# EAGLE design SatNOGSBoard UNO (EAGLE 6.5.0)
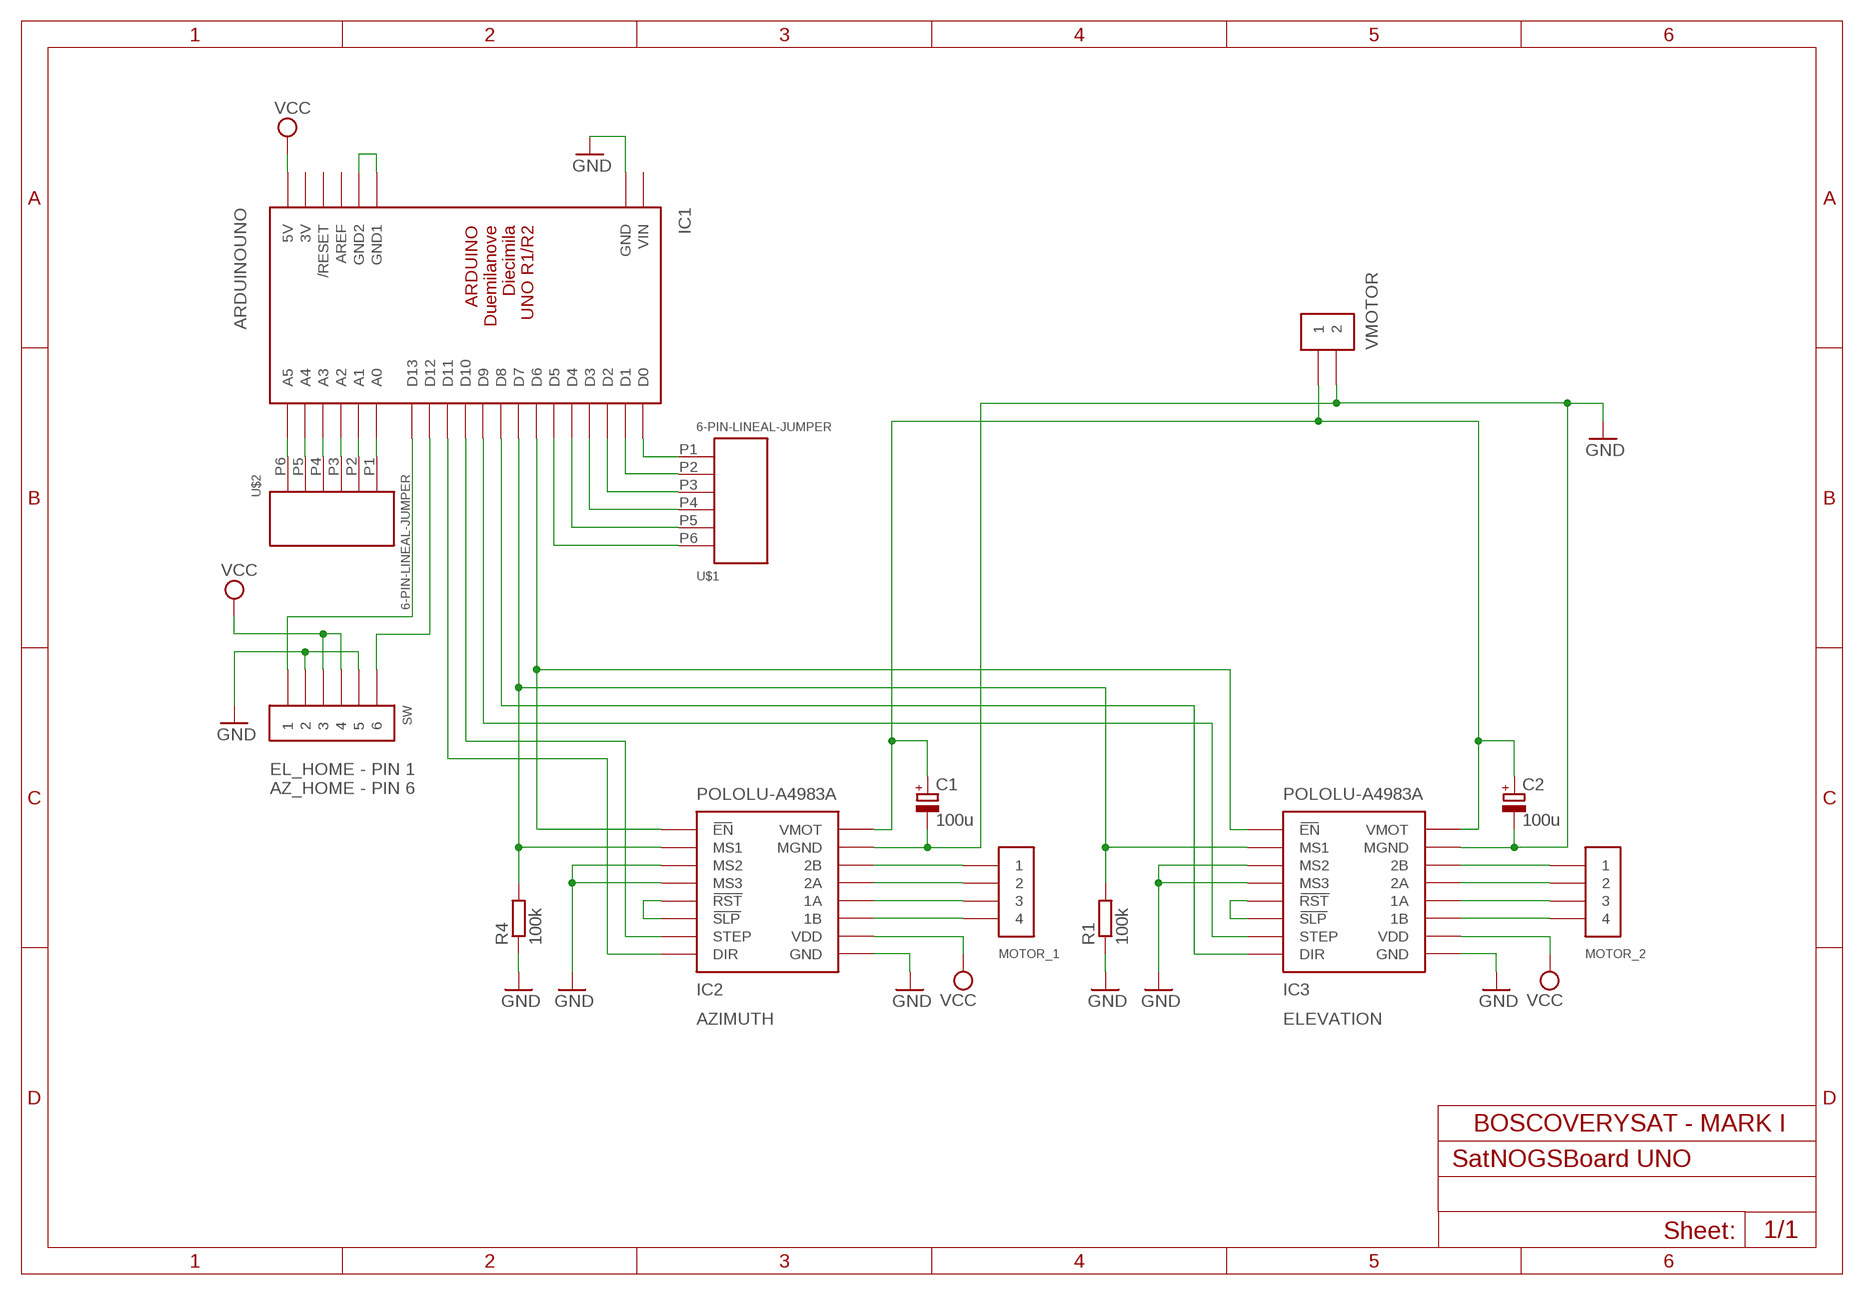
[diagram p0: schematic, sheet 1]

## Parts
C1  100u  CPOL-EUB45181B  [B45181B]
C2  100u  CPOL-EUB45181B  [B45181B]
IC1  ARDUINOUNO  [ARDUINO]
IC2  POLOLU-A4983A  [POLOLU-A4983]
IC3  POLOLU-A4983A  [POLOLU-A4983]
MOTOR_1  4-WIRE-CONNECTOR  [4-WIRE-CONNECTOR]
MOTOR_2  4-WIRE-CONNECTOR  [4-WIRE-CONNECTOR]
R1  100k  R-EU_0309/10  [0309/10]
R4  100k  R-EU_0309/10  [0309/10]
SW  6-PIN-JUMPER  [6-PIN-JUMPER]
U$1  6-PIN-LINEAL-JUMPER  [6-PIN-LINEAR-JUMPER]
U$2  6-PIN-LINEAL-JUMPER  [6-PIN-LINEAR-JUMPER]
VMOTOR  2-WIRE-CONNECTOR  [2-WIRE-CONNECTOR]

## Nets
GND: C1.- C2.- IC1.GND IC2.P$3(MS2) IC2.P$4(MS3) IC2.P$9(GND) IC2.P$15(MGND) IC3.P$3(MS2) IC3.P$4(MS3) IC3.P$9(GND) IC3.P$15(MGND) R1.1 R4.1 SW.P$2 SW.P$5 VMOTOR.P$2
N$1: IC1.D6 IC2.P$1(EN) IC3.P$1(EN)
N$2: IC1.D7 IC2.P$2(MS1) IC3.P$2(MS1) R1.2 R4.2
N$3: IC3.P$5(RST) IC3.P$6(SLP)
N$4: IC1.D9 IC3.P$7(STEP)
N$5: IC1.D8 IC3.P$8(DIR)
N$6: IC1.D0 U$1.P1
N$7: IC1.D1 U$1.P2
N$8: IC1.D11 IC2.P$8(DIR)
N$9: IC1.D12 SW.P$6
N$10: IC3.P$14(2B) MOTOR_2.P$1
N$11: IC3.P$13(2A) MOTOR_2.P$2
N$12: IC3.P$12(1A) MOTOR_2.P$3
N$13: IC3.P$11(1B) MOTOR_2.P$4
N$14: IC2.P$5(RST) IC2.P$6(SLP)
N$15: IC1.D2 U$1.P3
N$16: IC1.D13 SW.P$1
N$17: IC1.D3 U$1.P4
N$18: IC1.D10 IC2.P$7(STEP)
N$19: IC2.P$14(2B) MOTOR_1.P$1
N$20: IC2.P$13(2A) MOTOR_1.P$2
N$21: IC2.P$12(1A) MOTOR_1.P$3
N$22: IC2.P$11(1B) MOTOR_1.P$4
N$23: IC1.D4 U$1.P5
N$24: IC1.D5 U$1.P6
N$25: IC1.A0 U$2.P1
N$26: C1.+ C2.+ IC2.P$16(VMOT) IC3.P$16(VMOT) VMOTOR.P$1
N$27: IC1.A1 U$2.P2
N$28: IC1.A2 U$2.P3
N$29: IC1.A3 U$2.P4
N$30: IC1.A4 U$2.P5
N$31: IC1.A5 U$2.P6
N$33: IC1.GND1 IC1.GND2
VCC: IC1.5V IC2.P$10(VDD) IC3.P$10(VDD) SW.P$3 SW.P$4
Unconnected: IC1.AREF IC1.RESET(/RESET)

## Notes on the sheet
- EL_HOME - PIN 1
  AZ_HOME - PIN 6
- AZIMUTH | ELEVATION

## Power pins joined to a net without a drawn wire
3V: IC1.3V
VIN: IC1.VIN

## Library data of the parts
C1 C2 = resistor:CPOL-EU: POLARIZED CAPACITOR, European symbol
IC1 = boscoverysat:ARDUINO: Arduino Diecimila/Duemilanove Make a shield with ease, this package has all the named pins as well as the two mounting drill holes and an outline of the USB and DC power connector. The outline is on the DIMENSION layer, so if your board house uses it they will cut the outline to match. http://www.ladyada.net/library/pcb/eaglelibrary.html Package: ARDUINO Arduino Uno Make a shield with ease, this package has all the named pins as well as the two mounting drill holes and an outline of the USB and DC power connector. The outline is on the DIMENSION layer, so if your board house uses it they will cut the outline to match.
IC2 IC3 = boscoverysat:POLOLU-A4983: The A4983 stepper motor driver carrier is a breakout board for Allegro’s easy-to-use A4983 microstepping bipolar stepper motor driver. The driver features adjustable current limiting and five different microstep resolutions. It operates from 8 – 35 V and can deliver up to 2 A per coil.
MOTOR_1 MOTOR_2 = boscoverysat:4-WIRE-CONNECTOR
R1 R4 = resistor:R-EU_: RESISTOR, European symbol
SW = boscoverysat:6-PIN-JUMPER
U$1 U$2 = boscoverysat:6-PIN-LINEAL-JUMPER
VMOTOR = boscoverysat:2-WIRE-CONNECTOR

## Net classes
0 default: width 0.889 mm, drill 0.889 mm, clearance 0.889 mm

## Board
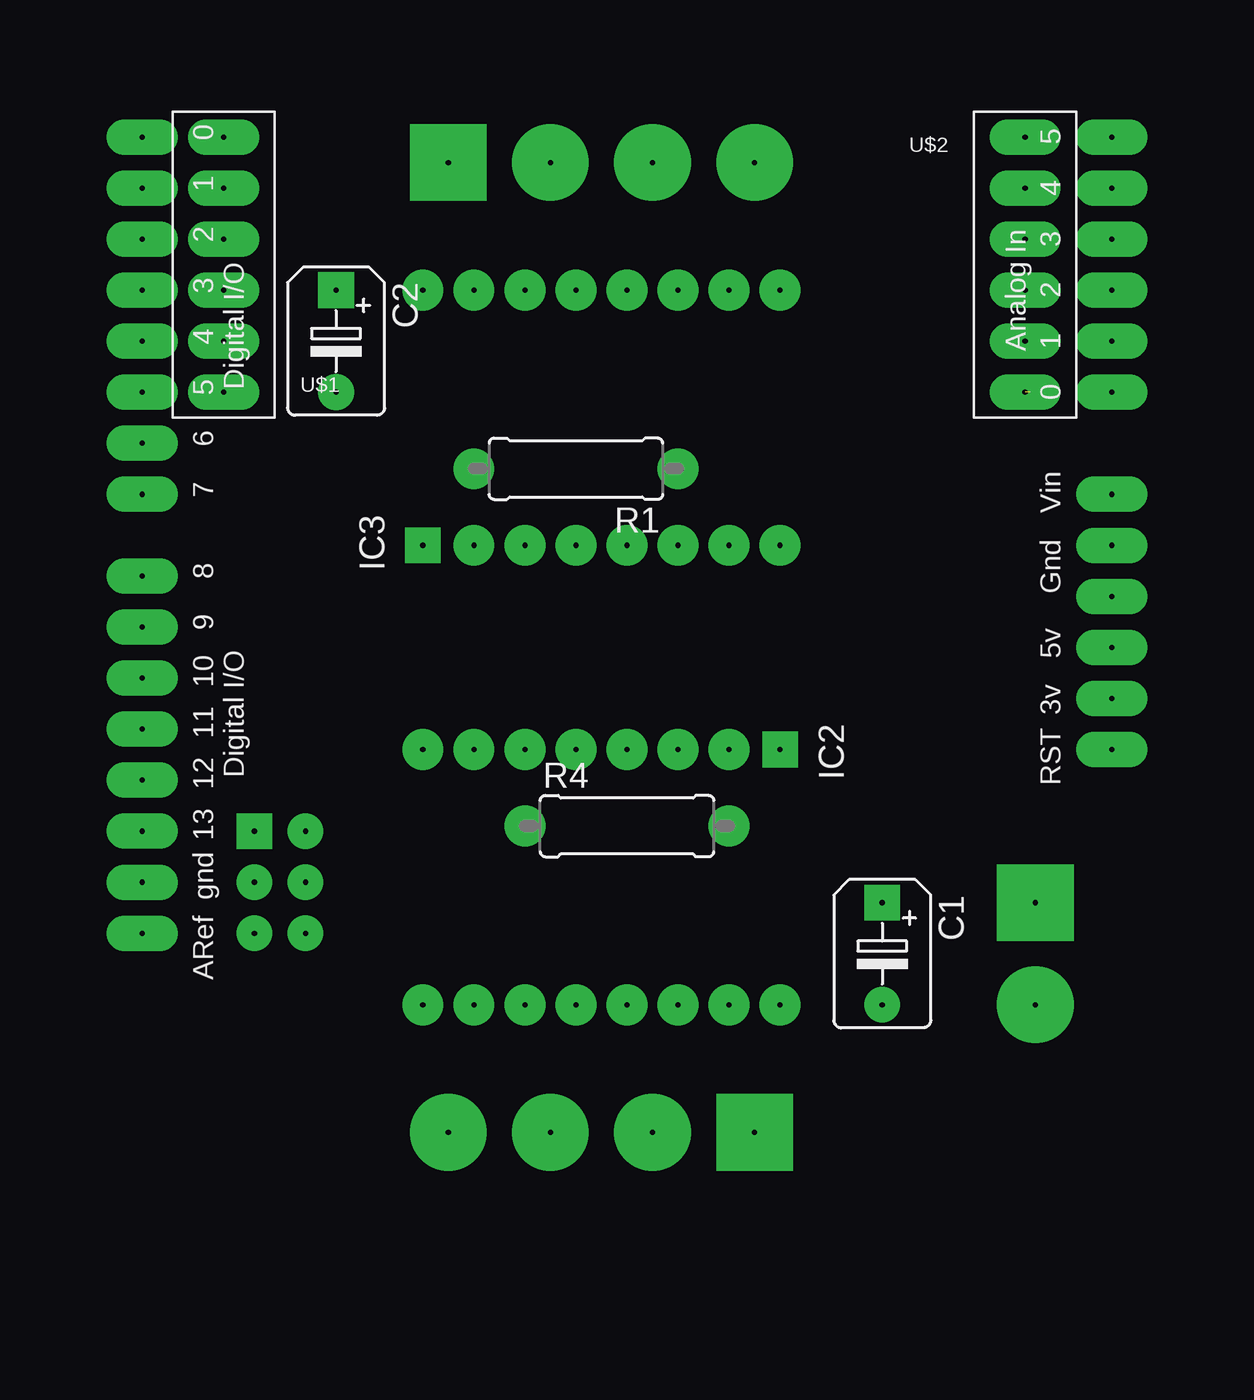
[diagram p1: board, top side]
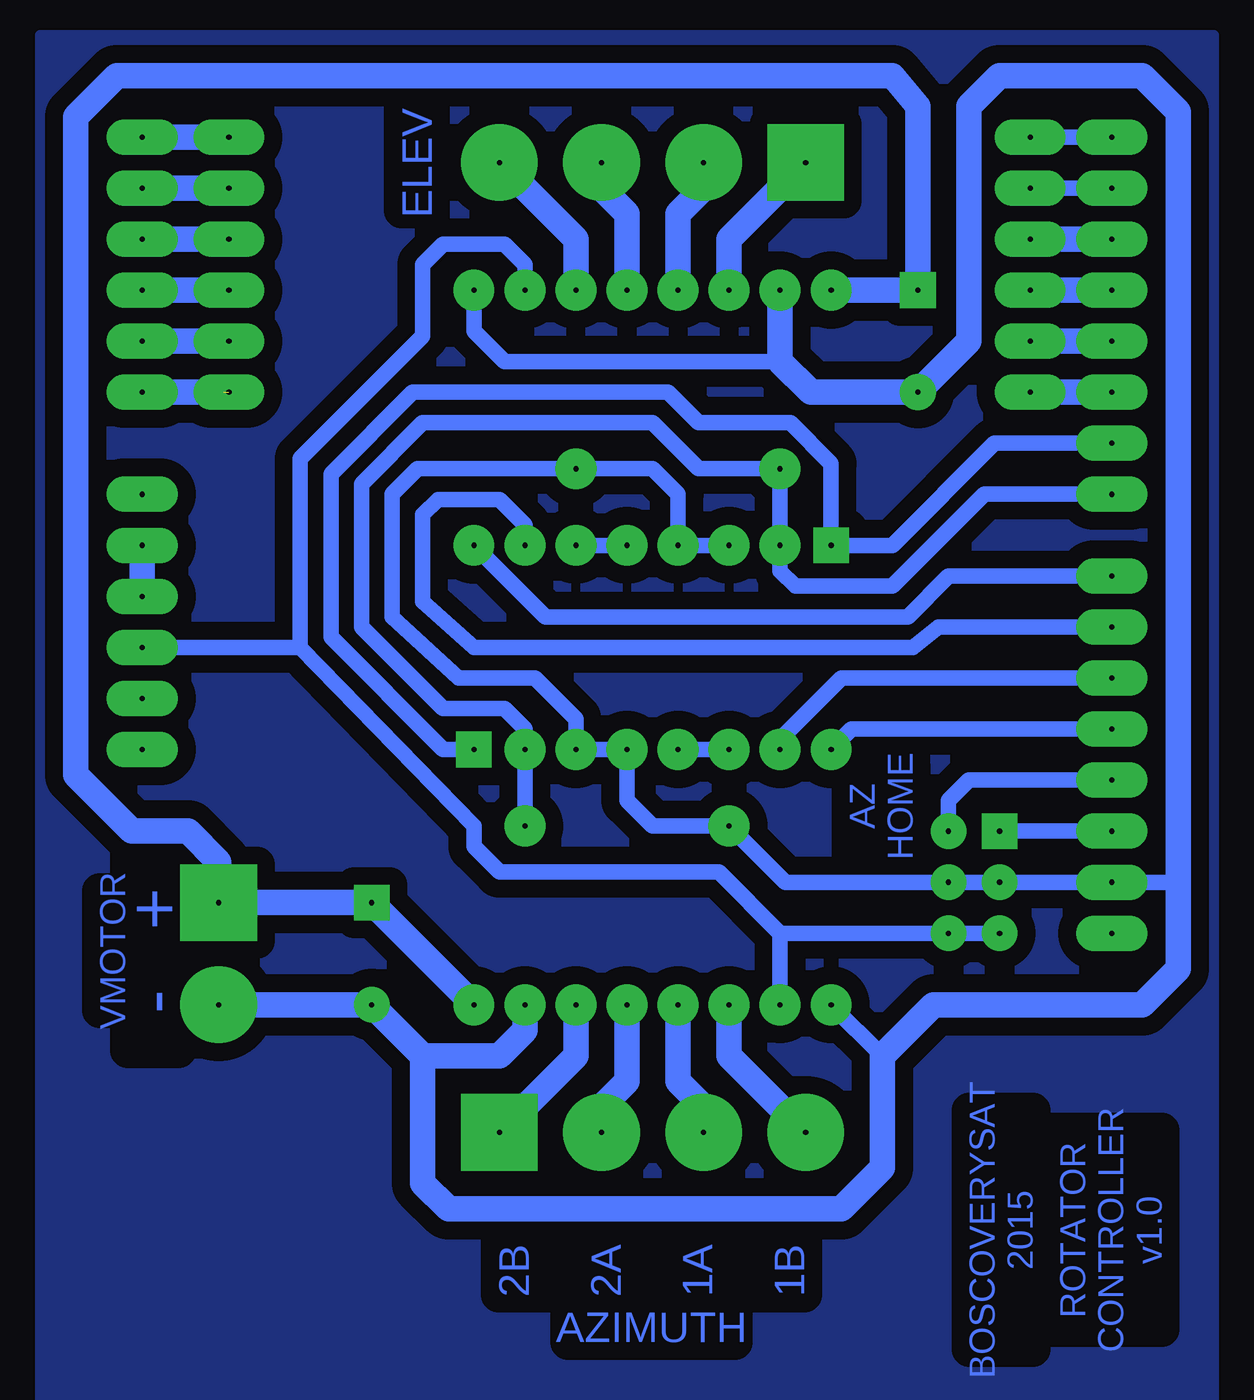
[diagram p2: board, bottom side, seen from below]

No outline drawn. Coordinates in mm, seen from the top.
Copper layers (1*16): Top 0.035mm / dielectric 1.5mm / Bottom 0.035mm
Design rules "default": minimum track width 10mil, minimum drill 24mil, track to track 8mil, track to pad 8mil, pad to pad 8mil, via to via 8mil, smd to smd 8mil, copper to edge 40mil, drill to drill 8mil, minimum pad ring 10mil, minimum via ring 8mil, stop-mask expansion 4mil, vias tented up to drill 0mil, thermal gap 10mil

### Footprints (pad centres in the part's own frame; a part is rotated, then mirrored left to right if it is on the bottom)
B45181B = drill 0.254 pad 1.778 square: + -2.54,0 | drill 0.254 pad 1.778: - 2.54,0
ARDUINO = drill 0.254 pad 1.778 long: 3V 35.56,2.54; 5V 38.1,2.54; A0 50.8,2.54; A1 53.34,2.54; A2 55.88,2.54; A3 58.42,2.54; A4 60.96,2.54; A5 63.5,2.54; AREF 23.876,50.8; D0 63.5,50.8; D1 60.96,50.8; D2 58.42,50.8; D3 55.88,50.8; D4 53.34,50.8; D5 50.8,50.8; D6 48.26,50.8; D7 45.72,50.8; D8 41.656,50.8; D9 39.116,50.8; D10 36.576,50.8; D11 34.036,50.8; D12 31.496,50.8; D13 28.956,50.8; GND 26.416,50.8; GND1 43.18,2.54; GND2 40.64,2.54; RESET 33.02,2.54; VIN 45.72,2.54
POLOLU-A4983 = drill 0.254 pad 1.778 square: P$1 -6.35,8.89 | drill 0.254 pad 2.032: P$2 -6.35,6.35; P$3 -6.35,3.81; P$4 -6.35,1.27; P$5 -6.35,-1.27; P$6 -6.35,-3.81; P$7 -6.35,-6.35; P$8 -6.35,-8.89; P$9 6.35,-8.89; P$10 6.35,-6.35; P$11 6.35,-3.81; P$12 6.35,-1.27; P$13 6.35,1.27; P$14 6.35,3.81; P$15 6.35,6.35; P$16 6.35,8.89
4-WIRE-CONNECTOR = drill 0.254 pad 3.81 square: P$1 -7.62,0 | drill 0.254 pad 3.81: P$2 -2.54,0; P$3 2.54,0; P$4 7.62,0
0309/10 = drill 0.254 pad 2.032: 1 -5.08,0; 2 5.08,0
6-PIN-JUMPER = drill 0.254 pad 1.778 square: P$1 0,0 | drill 0.254 pad 1.778: P$2 2.54,0; P$3 5.08,0; P$4 5.08,2.54; P$5 2.54,2.54; P$6 0,2.54
6-PIN-LINEAR-JUMPER = drill 0.254 pad 1.778 long: P1 0,12.7; P2 0,10.16; P3 0,7.62; P4 0,5.08; P5 0,2.54; P6 0,0
2-WIRE-CONNECTOR = drill 0.254 pad 3.81 square: P$1 -2.54,0 | drill 0.254 pad 3.81: P$2 2.54,0

### Placement (x,y rotation side)
C1  46.99,33.02 270 top
C2  19.81,63.5 270 top
IC1  60.96,10.16 90 top
IC2  33.02,36.83 270 top
IC3  33.02,59.69 90 top
MOTOR_1  33.02,24.13 180 top
MOTOR_2  33.02,72.39 0 top
R1  31.75,57.15 180 top
R4  34.29,39.37 0 top
SW  15.75,39.12 270 top
U$1  14.22,60.96 0 top
U$2  54.1,73.66 180 top
VMOTOR  54.61,33.02 270 top

### Tracks (layer width: path | path; a pad name or v marks a point on that pad's centre or on a via)
GND
  Bottom 0.762: IC3.P$3 IC3.P$4 31.75,55.88 33.02,57.15 R1.1 44.7,57.15 45.97,55.88 45.97,49.78 42.67,46.74 38.86,46.74 36.83,44.7 IC2.P$3 IC2.P$4 34.29,40.64 33.02,39.37 R4.1 26.42,36.58 SW.P$5 SW.P$2 IC1.GND 6.86,36.58 | IC2.P$9 21.59,27.94 | 26.67,62.48 40.39,62.48 41.91,64.01 IC3.P$9
  Bottom 1.27: VMOTOR.P$2 C1.- 44.45,27.94 | IC2.P$15 39.37,29.21 40.64,27.94 44.45,27.94 | 44.45,27.94 44.45,21.59 43.18,20.32 23.62,20.32 21.59,22.35 21.59,27.94 19.05,30.48 8.64,30.48 6.86,32.26 6.86,36.58 6.86,74.93 8.64,76.71 15.75,76.71 17.27,75.18 17.27,63.5 C2.- 25.15,60.96 26.67,62.48 IC3.P$15
N$1
  Bottom 0.762: IC1.D6 16,58.42 21.08,53.34 IC3.P$1 24.13,57.4 26.16,59.44 30.73,59.44 32.26,60.96 44.96,60.96 49.02,56.9 49.02,48.77 43.43,43.18 IC2.P$1
N$2
  Bottom 0.762: R4.2 IC2.P$2 39.37,44.2 40.39,45.21 43.43,45.21 47.5,49.28 47.5,56.39 44.45,59.44 33.02,59.44 30.73,57.15 R1.2 IC3.P$2 26.67,52.07 25.91,51.31 21.08,51.31 16.51,55.88 IC1.D7
N$3
  Bottom 0.762: IC3.P$6 IC3.P$5
N$4
  Bottom 0.762: IC3.P$7 39.37,54.36 40.64,55.63 43.69,55.63 44.45,54.86 44.45,50.55 41.91,48.26 20.07,48.26 18.8,49.28 IC1.D9
N$5
  Bottom 0.762: IC3.P$8 38.35,49.78 20.32,49.78 18.29,51.82 IC1.D8
N$6
  Bottom 0.762: U$1.P1 IC1.D0
N$7
  Bottom 0.762: U$1.P2 IC1.D1
N$8
  Bottom 0.762: IC2.P$8 23.11,44.2 IC1.D11
N$9
  Bottom 0.762: IC1.D12 17.27,41.66 18.29,40.64 SW.P$6
N$10
  Bottom 1.27: IC3.P$14 29.21,68.58 MOTOR_2.P$1
N$11
  Bottom 1.27: IC3.P$13 31.75,69.85 30.48,71.12 MOTOR_2.P$2
N$12
  Bottom 1.27: IC3.P$12 34.29,69.85 35.56,71.12 MOTOR_2.P$3
N$13
  Bottom 1.27: IC3.P$11 36.83,68.58 MOTOR_2.P$4
N$14
  Bottom 0.762: IC2.P$6 IC2.P$5
N$15
  Bottom 1.27: U$1.P3 IC1.D2
N$16
  Bottom 0.762: SW.P$1 IC1.D13
N$17
  Bottom 1.27: U$1.P4 IC1.D3
N$18
  Bottom 0.762: IC2.P$7 26.67,43.69 23.62,46.74 IC1.D10
N$19
  Bottom 1.27: IC2.P$14 36.83,27.94 MOTOR_1.P$1
N$20
  Bottom 1.27: IC2.P$13 34.29,26.67 35.56,25.4 MOTOR_1.P$2
N$21
  Bottom 1.27: IC2.P$12 31.75,26.67 30.48,25.4 MOTOR_1.P$3
N$22
  Bottom 1.27: IC2.P$11 29.21,27.94 MOTOR_1.P$4
N$23
  Bottom 1.27: U$1.P5 IC1.D4
N$24
  Bottom 1.27: U$1.P6 IC1.D5
N$25  (1 unrouted)
  Bottom 1.27: 54.36,60.96 IC1.A0
N$26
  Bottom 1.27: IC2.P$16 C1.+ VMOTOR.P$1 54.61,37.59 56.13,39.12 58.93,39.12 61.72,41.91 61.72,74.68 59.69,76.71 21.08,76.71 19.81,75.18 C2.+ IC3.P$16
N$27
  Bottom 1.27: U$2.P2 IC1.A1
N$28
  Bottom 1.27: U$2.P3 IC1.A2
N$29
  Bottom 1.27: U$2.P4 IC1.A3
N$30
  Bottom 1.27: U$2.P5 IC1.A4
N$31
  Bottom 1.27: U$2.P6 IC1.A5
N$32
  pour Bottom: 5.08,10.16 63.5,10.16 63.5,78.74 5.08,78.74
N$33
  Bottom 1.27: IC1.GND1 IC1.GND2
VCC
  Bottom 0.762: 26.67,34.04 IC2.P$10 | IC3.P$10 39.37,67.31 40.39,68.33 43.43,68.33 44.45,67.31 44.45,63.75 50.55,57.66 50.55,48.26 | 50.55,48.26 IC1.5V | 50.55,48.26 41.91,39.37 41.91,38.35 40.64,37.08 29.72,37.08 26.67,34.04 | SW.P$3 SW.P$4 26.67,34.04

### Text on the board
Bottom: ELEV | AZ / HOME | - + | VMOTOR | ROTATOR / CONTROLLER / v1.0 | BOSCOVERYSAT / 2015 | 2B / / 2A / / 1A / / 1B | AZIMUTH
Document: ELEVATION | 2B | 2A | 1A | 1B | D0 / RX | A5 | D1 / TX | A4 | D2 | A3 | D3 | A2 | D4 | A1 | D5 | A0 | SW_EL | SW_AZ | GND | +12V DC MOTOR | +5V DC | GND | 1B | 1A | 2A | 2B | AZMUTH